# EAGLE design 電源 (EAGLE 9.6.2)
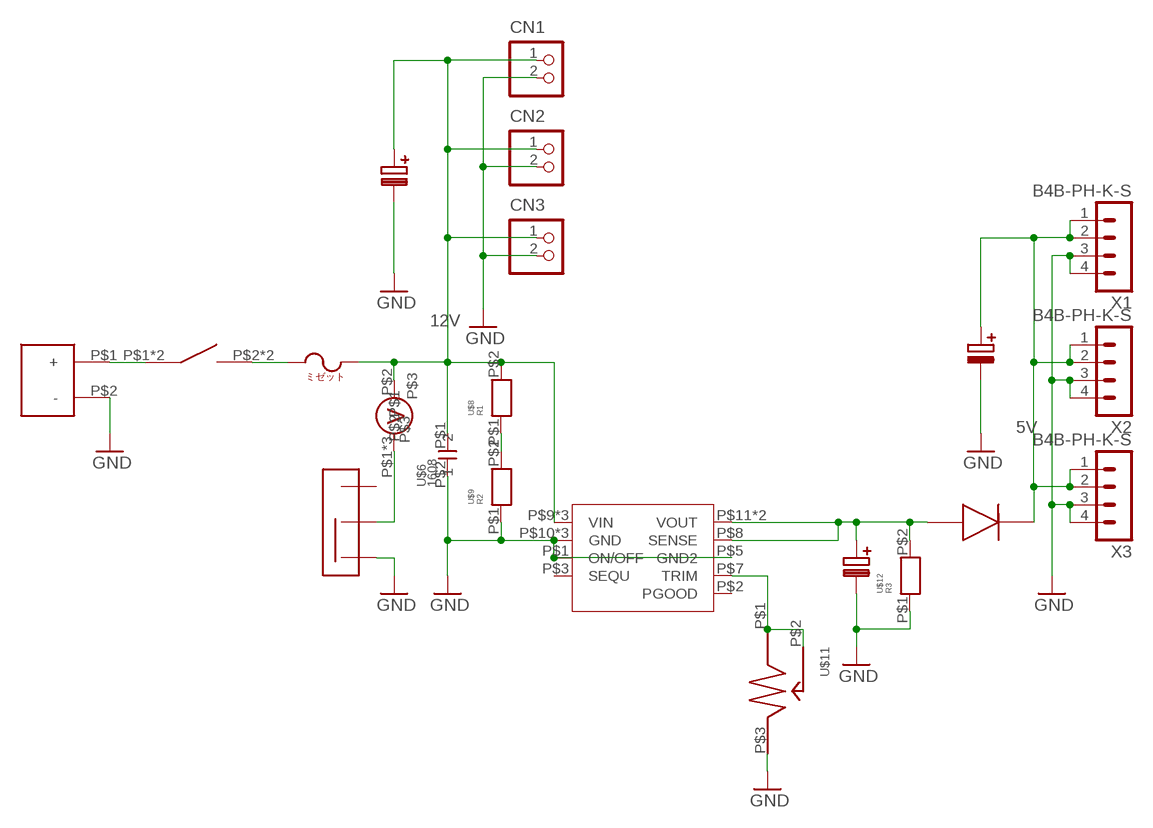
[diagram p0: schematic, sheet 1]

## Parts
CN1  S2B-XH-A  [S2B-XH-A]
CN2  S2B-XH-A  [S2B-XH-A]
CN3  S2B-XH-A  [S2B-XH-A]
U$1  XT60  [XT60]
U$2  MF  [ｍｆ]
U$3  V  [V]
U$4  SW3  [SW3]
U$5  DCDC  [DC-DC]
U$6  1608  [CON]
U$7  25V100  [25V100]
U$8  R1  R  [1608]
U$9  R2  R  [1608]
U$10  40V5A  [40V5A]
U$11  VR  [VR]
U$12  R3  R  [1608]
U$15  25V100  [25V100]
U$16  SSW  [SSW]
U$19  25V100  [25V100]
X1  B4B-PH-K-S  [B4B-PH-K-S]
X2  B4B-PH-K-S  [B4B-PH-K-S]
X3  B4B-PH-K-S  [B4B-PH-K-S]

## Nets
5V: U$10.P$2 U$19.P$1 X1.1 X1.2 X2.1 X2.2 X3.1 X3.2
12V: CN1.1 CN2.1 CN3.1 U$2.P$3 U$2.P$4 U$3.P$2 U$5.P$9(VIN) U$5.P$14(VIN) U$5.P$15(VIN) U$6.P$1 U$8.P$2 U$15.P$1
GND: CN1.2 CN2.2 CN3.2 U$1.P$2(-) U$5.P$1(ON/OFF) U$5.P$5(GND2) U$5.P$10(GND) U$5.P$16(GND) U$5.P$17(GND) U$6.P$2 U$7.P$2 U$9.P$1 U$11.P$3 U$12.P$1 U$15.P$2 U$16.P$1 U$19.P$2 X1.3 X1.4 X2.3 X2.4 X3.3 X3.4
N$3: U$1.P$1(+) U$4.P$1 U$4.P$3
N$4: U$2.P$1 U$2.P$2 U$4.P$2 U$4.P$4
N$5: U$5.P$8(SENSE) U$5.P$11(VOUT) U$5.P$18(VOUT) U$7.P$1 U$10.P$1 U$12.P$2
N$6: U$8.P$1 U$9.P$2
N$7: U$5.P$7(TRIM) U$11.P$1 U$11.P$2
N$9: U$3.P$1 U$3.P$4 U$3.P$5 U$16.P$3
Unconnected: U$3.P$3 U$5.P$2(PGOOD) U$5.P$3(SEQU) U$16.P$2

## Library data of the parts
CN1-CN3 = jst-xh:S2B-XH-A: Wire-to-Board 2.5mm pitch side mount connector Source: http://www.jst-mfg.com/product/pdf/jpn/XH.pdf http://www.jst-mfg.com/product/detail.php?series=277
U$1 = XT60:XT60
U$2 = ミゼットヒューズ:MF
U$3 = voltmeter:V
U$4 = SW3:SW3
U$5 = OKL:DCDC
U$6 = con1608:1608
U$7 U$15 U$19 = 100uF25V 電解:25V100
U$8 U$9 U$12 = R 1608:R
U$10 = D40V5A:40V5A
U$11 = VR tippu:VR
U$16 = SSW:SSW
X1-X3 = con-JST PH:B4B-PH: JST PH series header 2.00mm pitch disconnectable crimp style connectors, vertical (side entry type), 4 pins

## Board
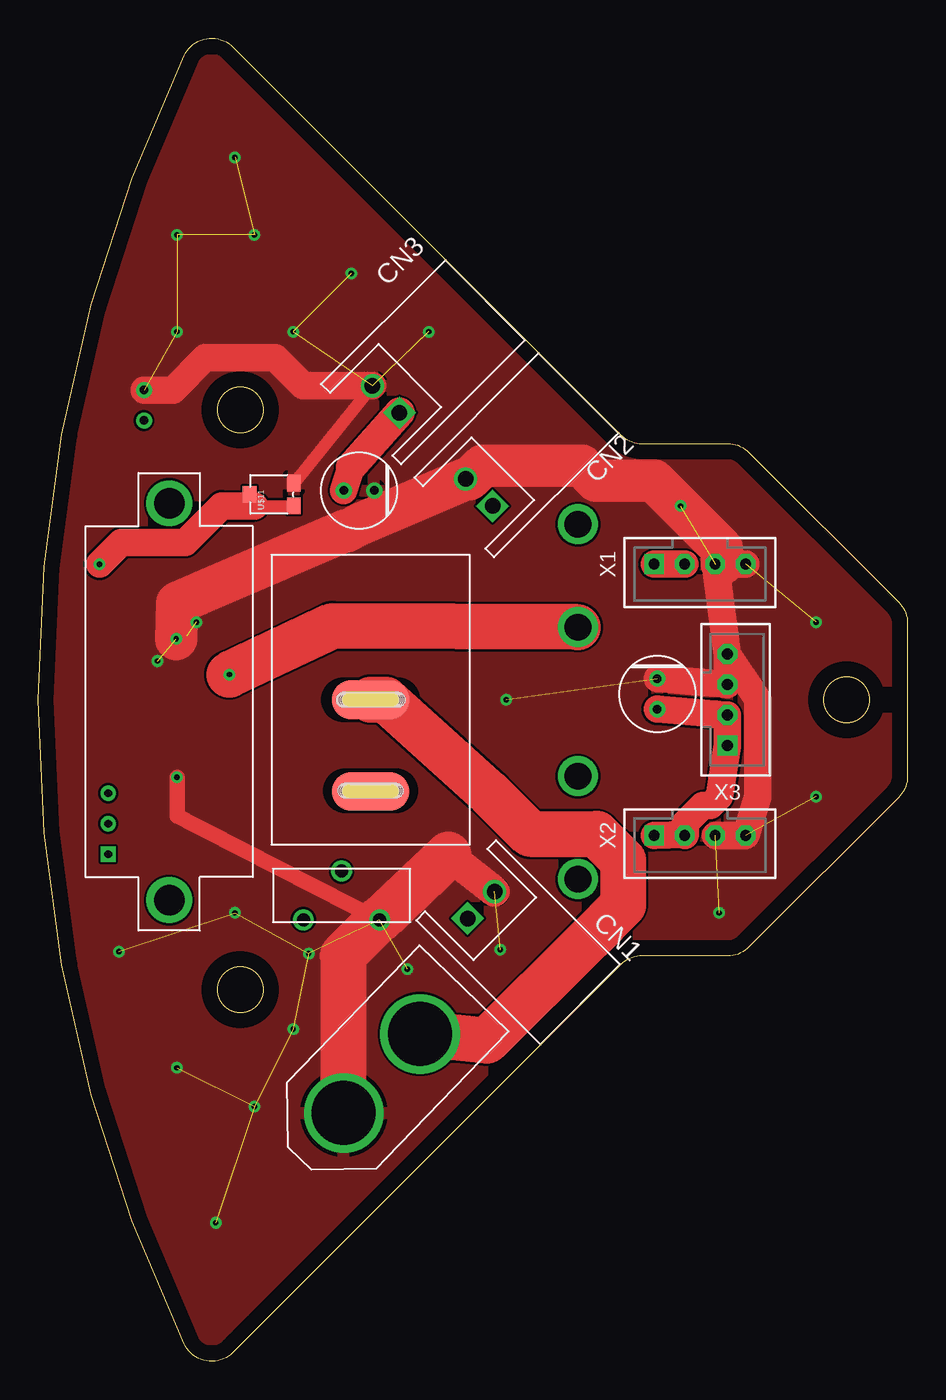
[diagram p1: board, top side]
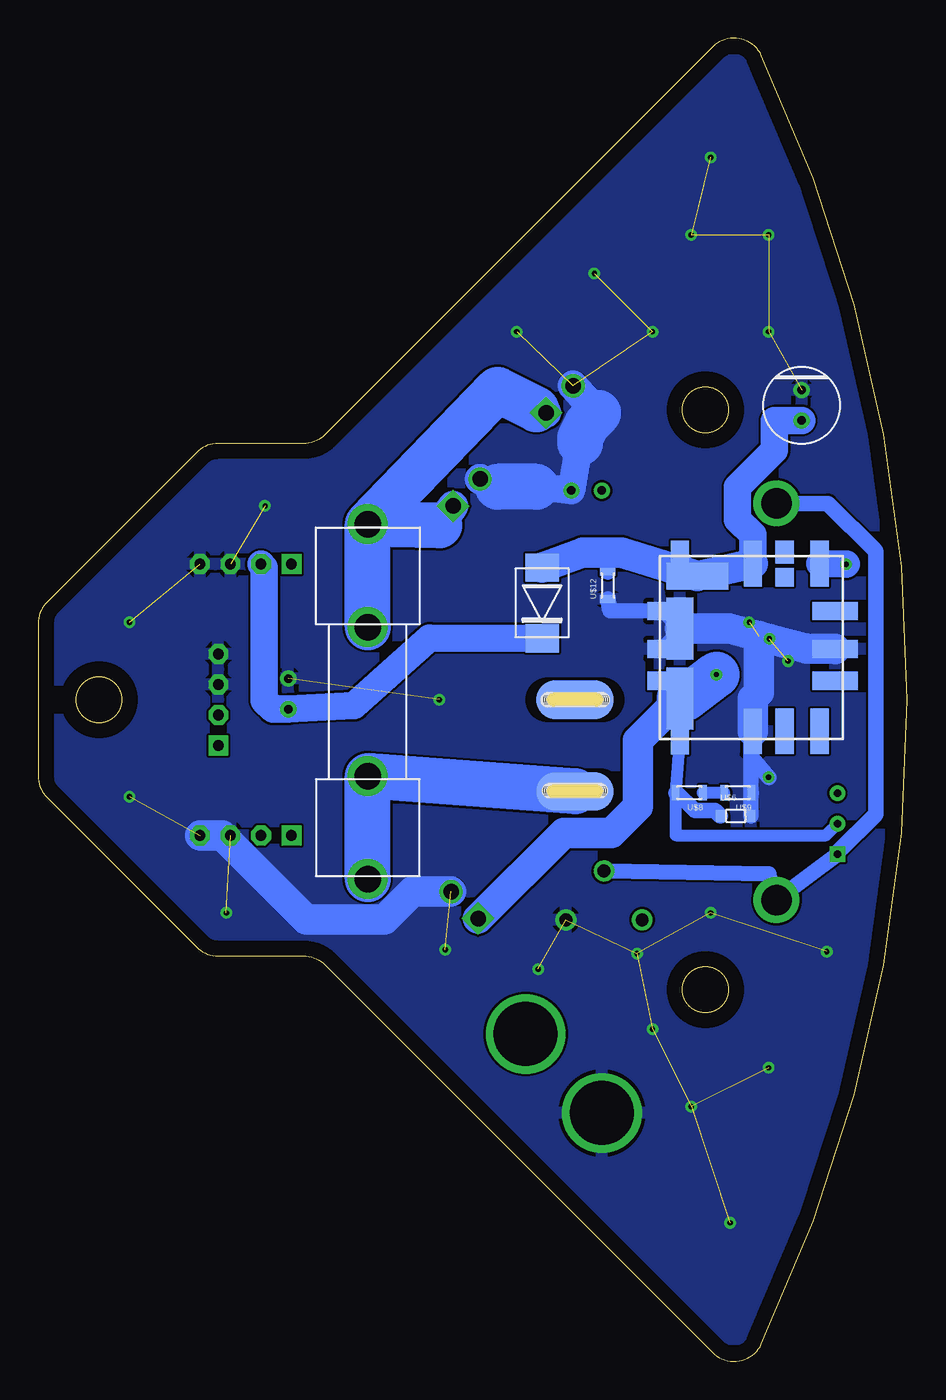
[diagram p2: board, bottom side, seen from below]

Size 57 x 86.74 mm. Coordinates in mm from the lower left corner, seen from the top.
Outline: 12.79,0.59 arc-109 9.57,1.14 arc-51 9.57,85.61 arc-109 12.79,86.16 38.19,60.76 arc45 39.6,60.17 45.2,60.17 arc-45 46.61,59.59 56.41,49.78 arc-45 57,48.37 57,38.38 arc-45 56.41,36.96 46.61,27.16 arc-45 45.2,26.57 39.6,26.57 arc45 38.19,25.99 12.79,0.59
Outline: circle at 13.25,62.37 radius 1.5
Outline: circle at 13.25,24.37 radius 1.5
Outline: circle at 53,43.37 radius 1.5
Outline: circle at 13.25,24.37 radius 1.5
Outline: circle at 13.25,62.37 radius 1.5
Copper layers (1*16): Top 0.035mm / dielectric 1.5mm / Bottom 0.035mm
Design rules "default": minimum track width 6mil, minimum drill 0.35mm, track to track 6mil, track to pad 6mil, pad to pad 6mil, via to via 6mil, smd to smd 6mil, copper to edge 40mil, drill to drill 6mil, minimum pad ring 10mil, minimum via ring 8mil, stop-mask expansion 4mil, vias tented up to drill 0mil, thermal gap 10mil
Holes 0.9 mm at 21.8,43.37 20.53,43.37 23.07,43.37 20.15,43.37 20.28,43.37 20.4,43.37 20.66,43.37 20.78,43.37 20.91,43.37 21.04,43.37 21.17,43.37 21.29,43.37 21.42,43.37 21.55,43.37 21.67,43.37 21.93,43.37 22.05,43.37 22.18,43.37 22.44,43.37 22.31,43.37 22.56,43.37 22.69,43.37 22.82,43.37 22.94,43.37 23.58,43.37 23.45,43.37 23.32,43.37 23.2,43.37 20.02,43.37 20.66,37.4 20.28,37.4 20.4,37.4 20.53,37.4 20.78,37.4 20.91,37.4 21.04,37.4 20.15,37.4 21.67,37.4 21.29,37.4 21.42,37.4 21.55,37.4 21.8,37.4 21.93,37.4 22.05,37.4 21.17,37.4 22.69,37.4 22.31,37.4 22.44,37.4 22.56,37.4 22.82,37.4 22.94,37.4 23.07,37.4 22.18,37.4 23.07,37.4 22.69,37.4 22.82,37.4 22.94,37.4 23.2,37.4 23.32,37.4 23.45,37.4 22.56,37.4

### Footprints (pad centres in the part's own frame; a part is rotated, then mirrored left to right if it is on the bottom)
S2B-XH-A = drill 1.016 square: 1 1.25,0 | drill 1.016: 2 -1.25,0
XT60 = drill 4.2: P$1 -3.6,0; P$2 3.6,0
ｍｆ = drill 1.75: P$1 -6.55,0; P$2 0.2,0; P$3 9.96,0; P$4 16.71,0
V = drill 0.5 square: P$1 10,-4 | drill 0.5: P$2 8,-4; P$3 6,-4 | drill 2: P$4 -13,0; P$5 13,0
SW3 = smd 2.54 x 5.08: P$1 0,0; P$2 -6,0 | smd 2.54 x 5.08 bottom: P$3 0,0; P$4 -6,0
DC-DC = smd 3 x 1.2: P$1 -5.5,-0.1; P$2 -5.5,-2.19; P$3 -5.5,-4.48; P$7 5.5,-4.48; P$8 5.5,-0.1 | smd 1.2 x 3: P$4 -2.19,-5.5; P$5 -0.1,-5.5; P$6 2.39,-5.5 | smd 4.07 x 1.77: P$9 -3.335,4.685; P$10 1.245,4.685 | smd 1.77 x 4.07: P$11 4.685,3.535 | smd 1.5 x 1.2: P$12 6.25,-2.19 | smd 1.2 x 1.2: P$13 4.6,-2.19 | smd 1.63 x 1.2: P$14 -6.2,4.685; P$18 6.2,4.68 | smd 1.2 x 1.63: P$15 -2.19,6; P$16 -0.1,6; P$17 2.39,6
CON = smd 0.6 x 0.813: P$1 -1,0; P$2 1,0
25V100 = drill 0.55: P$1 -1,0; P$2 1,0
1608 = smd 0.508 x 1.016: P$1 -0.889,0; P$2 0.889,0
40V5A = smd 1.85 x 2.2: P$1 -2.325,0; P$2 2.325,0
VR = smd 1.1 x 0.9: P$1 0,1.45; P$2 -0.75,-1.45; P$3 0.75,-1.45
SSW = drill 0.85: P$1 -2.5,1.6; P$2 2.5,1.6; P$3 0,-1.6
B4B-PH-K-S = drill 0.7 pad 1.3 square: 1 3,0 | drill 0.7 pad 1.3 octagon: 2 1,0; 3 -1,0; 4 -3,0

### Placement (x,y rotation side)
CN1  29.04,29.91 225 top
CN2  28.91,56.96 315 top
CN3  22.81,63.07 315 top
U$1  22.54,18.87 226 top
U$2  35.39,38.17 90 bottom
U$3  8.59,43.25 270 top
U$4  21.8,43.37 90 top
U$5  10.24,46.8 90 bottom
U$6  11.26,35.75 0 bottom
U$7  6.94,62.68 90 bottom
U$8  14.31,37.28 180 bottom
U$9  11.13,37.28 180 bottom
U$10  23.96,49.72 270 bottom
U$11  15.32,56.83 90 top
U$12  19.64,50.87 90 bottom
U$15  21.04,57.09 0 top
U$16  19.9,30.55 180 top
U$19  40.6,43.75 90 top
X1  43.39,52.26 180 top
X2  43.39,34.48 180 top
X3  45.19,43.37 270 top

### Tracks (layer width: path | path; a pad name or v marks a point on that pad's centre or on a via)
5V
  Top 1.8: X1.1 X1.2 | U$19.P$1 44.36,42.44 44.38,42.42 44.61,42.42 X3.2 X3.1 44.66,37.02 44.07,36.43 43.58,36.43 42.44,35.29 42.44,34.53 | 42.44,34.53 X2.2 | X2.1 42.44,34.53
  Bottom 1.8: U$10.P$2 31.34,47.43 36.28,42.99 U$19.P$1 41.59,42.75 42.18,43.34 42.18,52.05 X1.2
12V  (via drill 0.35)
  Top 1.8: 20.53,58.61 U$15.P$1
  Top 2: CN3.1 20.53,58.61
  Top 3: U$2.P$3 19.29,48.2 v12.53,45.02
  Bottom 0.8: U$3.P$2 5.35,34.48 15.2,34.48 U$8.P$2 U$5.P$14 U$5.P$9 U$5.P$15
  Bottom 1.016: U$6.P$1 12.62,36.11 13.95,36.11 15.11,37.28 U$8.P$2
  Bottom 2: CN2.1 30.69,54.8 | 24.34,62.42 CN3.1 | CN1.1 22.54,34.65 19.42,34.65 17.68,36.38 17.68,40.71 U$5.P$9
  Bottom 3: 30.69,54.8 U$2.P$4 | U$2.P$4 26.88,63.69 24.34,62.42 | U$2.P$3 U$2.P$4 | v12.53,45.02 14.59,43.47 U$5.P$9
GND  (via drill 0.35)  (23 unrouted)
  Top 0.8: U$11.P$3 CN3.2
  Top 1: U$16.P$1 9.1,35.75 v9.1,38.29
  Top 1.8: X1.4 44.84,52.26 X1.3 X3.4 | X3.4 X3.3 U$19.P$2 | X2.3 X2.4 47.2,37.02 47.2,43.37 X3.4 | U$7.P$2 8.84,63.68 10.96,65.79 15.55,65.79 17.38,63.95 CN3.2
  Top 2: CN1.2 26.88,33.21
  Top 2.8: 44.84,52.26 44.84,53.28 40.38,57.74 36.58,57.74 35.61,58.71 29.15,58.71 28.29,57.85 CN2.2 21.04,54.85 20.25,54.44 20.16,54.47 9.1,49.72 v9.05,47.36
  Top 3: U$1.P$2 19.98,16.33 19.98,26.61 22.32,28.95 U$16.P$1 26.88,33.21
  Bottom 0.8: U$9.P$1 10.19,39.56 U$5.P$1 | U$5.P$17 U$5.P$10 U$5.P$16
  Bottom 1: v9.1,38.29 10.19,39.56 | U$5.P$17 19.51,49.21 U$12.P$1
  Bottom 1.016: U$6.P$2 10.26,37.26 U$9.P$1 10.27,37.3 10.27,41.17 U$5.P$1
  Bottom 1.8: 24.34,57.34 U$15.P$2 21.47,60.35
  Bottom 2: CN3.2 20.3,62.16 | CN2.2 26.88,57.34 | CN1.2 32.46,30.79 34.29,28.96 39.42,28.96 44.94,34.48 X2.4 | U$5.P$1 10.14,43.46 9.75,43.85 9.74,47.56 | U$5.P$10 11.7,48.05 v9.05,47.36 6.63,46.74 U$5.P$5
  Bottom 3: 24.34,57.34 26.88,57.34 | 20.3,62.16 21.02,61.44 21.47,60.55 21.47,60.35 21.47,60.22
  other vias: 17.74,26.74 12.91,29.4 16.72,21.78 24.21,25.72 30.31,26.99 9.1,19.24 14.18,16.7 5.29,26.86 20.53,71.31 51.01,48.45 9.1,73.85 10.37,48.45 16.72,67.5 51.01,37.02 44.66,29.4 14.18,73.85 42.12,56.07 30.69,43.37 11.64,9.08 25.61,67.5 7.83,45.91 12.91,78.93 9.1,67.5
  pour Bottom: 5.29,89.09 -9.95,43.37 5.29,-7.43 17.99,-7.43 64.98,37.02 64.98,59.88 10.37,90.36
  pour Top: 14.18,92.9 -1.06,85.28 -18.84,20.51 11.64,-6.16 52.28,-3.62 68.79,58.61
N$3  (1 unrouted)
  Top 3: U$4.P$3 22.79,43.37 29.61,37.23 32.26,34.58 36.62,34.58 38.35,32.84 38.35,29.92 36.11,27.68 29.42,21.02 U$1.P$1
N$4  (1 unrouted)
  Bottom 3: U$2.P$1 U$2.P$2 U$4.P$2
N$5
  Bottom 0.8: U$5.P$18 U$5.P$11
  Bottom 1: U$12.P$2 19.77,53.02
  Bottom 1.8: U$7.P$1 8.72,61.66 8.72,59.73 11.14,57.3 11.14,55.19 10.14,54.19 U$5.P$8
  Bottom 2: U$5.P$8 U$5.P$11 18.75,53.02 19.77,53.02 21.29,53.02 U$10.P$1
N$6
  Bottom 0.8: U$9.P$2 U$8.P$1
N$7  (via drill 0.35)
  Top 0.8: U$11.P$1 13.93,56.07 U$11.P$2
  Top 1.8: 14.18,56.07 13.93,56.07 12.03,56.07 9.65,53.69 5.45,53.69 v4.02,52.26
  Bottom 1.8: v4.02,52.26 U$5.P$7
N$9
  Bottom 1: U$16.P$3 9.1,31.94 U$3.P$5 U$3.P$1 4.59,33.36 2.08,35.87 2.08,53.11 5.22,56.25 U$3.P$4